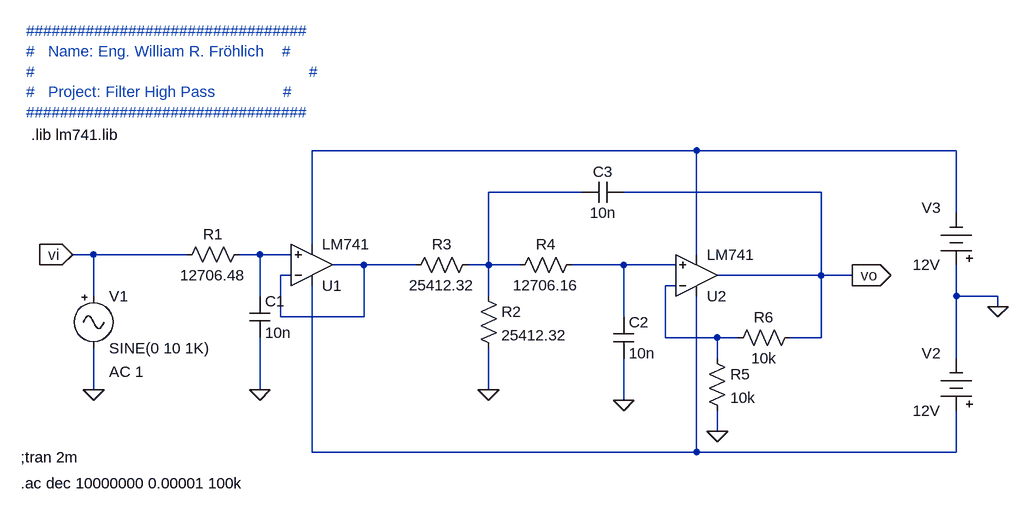
[diagram p0: schematic Filter_High_Pass_Active01.asc]
Filter_High_Pass_Active01.asc, the LTspice schematic file:
Version 4
SHEET 1 1156 680
WIRE 672 0 80 0
WIRE 1072 0 672 0
WIRE 496 64 352 64
WIRE 864 64 560 64
WIRE 1072 96 1072 0
WIRE 80 144 80 0
WIRE -256 160 -288 160
WIRE -112 160 -256 160
WIRE 0 160 -32 160
WIRE 48 160 0 160
WIRE 672 160 672 0
WIRE 160 176 112 176
WIRE 240 176 160 176
WIRE 352 176 352 64
WIRE 352 176 320 176
WIRE 400 176 352 176
WIRE 560 176 480 176
WIRE 640 176 560 176
WIRE 48 192 32 192
WIRE 864 192 864 64
WIRE 864 192 704 192
WIRE 912 192 864 192
WIRE 640 208 624 208
WIRE -256 224 -256 160
WIRE 0 224 0 160
WIRE 352 224 352 176
WIRE 1072 224 1072 176
WIRE 1136 224 1072 224
WIRE 1136 240 1136 224
WIRE 32 256 32 192
WIRE 160 256 160 176
WIRE 160 256 32 256
WIRE 560 256 560 176
WIRE 624 288 624 208
WIRE 704 288 624 288
WIRE 736 288 704 288
WIRE 864 288 864 192
WIRE 864 288 816 288
WIRE 704 320 704 288
WIRE 1072 320 1072 224
WIRE -256 368 -256 304
WIRE 0 368 0 288
WIRE 352 368 352 304
WIRE 560 384 560 320
WIRE 704 432 704 400
WIRE 80 464 80 208
WIRE 672 464 672 224
WIRE 672 464 80 464
WIRE 1072 464 1072 400
WIRE 1072 464 672 464
FLAG 0 368 0
FLAG -256 368 0
FLAG 352 368 0
FLAG 560 384 0
FLAG -288 160 vi
IOPIN -288 160 In
FLAG 912 192 vo
IOPIN 912 192 Out
FLAG 704 432 0
FLAG 1136 240 0
SYMBOL Opamps\\opamp2 80 240 M180
SYMATTR InstName U1
SYMATTR Value LM741
SYMBOL Opamps\\opamp2 672 256 M180
SYMATTR InstName U2
SYMATTR Value LM741
SYMBOL res -16 144 R90
WINDOW 0 0 56 VBottom 2
WINDOW 3 32 56 VTop 2
SYMATTR InstName R1
SYMATTR Value 12706.48
SYMBOL cap -16 224 R0
SYMATTR InstName C1
SYMATTR Value 10n
SYMBOL Misc\\signal -256 208 R0
WINDOW 123 24 132 Left 2
WINDOW 39 0 0 Left 2
SYMATTR Value2 AC 1
SYMATTR InstName V1
SYMATTR Value SINE(0 10 1K)
SYMBOL res 336 208 R0
SYMATTR InstName R2
SYMATTR Value 25412.32
SYMBOL res 224 192 R270
WINDOW 0 32 56 VTop 2
WINDOW 3 0 56 VBottom 2
SYMATTR InstName R3
SYMATTR Value 25412.32
SYMBOL res 384 192 R270
WINDOW 0 32 56 VTop 2
WINDOW 3 0 56 VBottom 2
SYMATTR InstName R4
SYMATTR Value 12706.16
SYMBOL cap 544 256 R0
SYMATTR InstName C2
SYMATTR Value 10n
SYMBOL cap 560 48 R90
WINDOW 0 0 32 VBottom 2
WINDOW 3 32 32 VTop 2
SYMATTR InstName C3
SYMATTR Value 10n
SYMBOL res 688 304 R0
SYMATTR InstName R5
SYMATTR Value 10k
SYMBOL res 832 272 R90
WINDOW 0 0 56 VBottom 2
WINDOW 3 32 56 VTop 2
SYMATTR InstName R6
SYMATTR Value 10k
SYMBOL Misc\\battery 1072 416 R180
WINDOW 0 24 104 Left 2
WINDOW 3 24 16 Left 2
WINDOW 123 0 0 Left 2
WINDOW 39 0 0 Left 2
SYMATTR InstName V2
SYMATTR Value 12V
SYMBOL Misc\\battery 1072 192 R180
WINDOW 0 24 104 Left 2
WINDOW 3 24 16 Left 2
WINDOW 123 0 0 Left 2
WINDOW 39 0 0 Left 2
SYMATTR InstName V3
SYMATTR Value 12V
TEXT -352 -24 Left 2 !.lib lm741.lib
TEXT -368 472 Left 2 !;tran 2m
TEXT -368 512 Left 2 !.ac dec 10000000 0.00001 100k
TEXT -360 -184 Left 2 ;#################################\n#   Name: Eng. William R. Fröhlich    #\n#                                                             #\n#   Project: Filter High Pass               #\n#################################

The netlist it stands for:
* Filter_High_Pass_Active01.asc
XU1 N003 N004 N007 N001 N004 LM741  ; pins In+ In- V+ V- OUT
XU2 N005 N006 N007 N001 vo LM741  ; pins In+ In- V+ V- OUT
R1 N003 vi 12706.48
C1 N003 0 10n
V1 vi 0 SINE(0 10 1K) AC 1
R2 N002 0 25412.32
R3 N004 N002 25412.32
R4 N002 N005 12706.16
C2 N005 0 10n
C3 vo N002 10n
R5 N006 0 10k
R6 vo N006 10k
V2 N007 0 12V
V3 0 N001 12V
.lib lm741.lib
;tran 2m
.ac dec 10000000 0.00001 100k
* #################################
* #   Name: Eng. William R. Fröhlich    #
* #                                                             #
* #   Project: Filter High Pass               #
* #################################
.backanno
.end